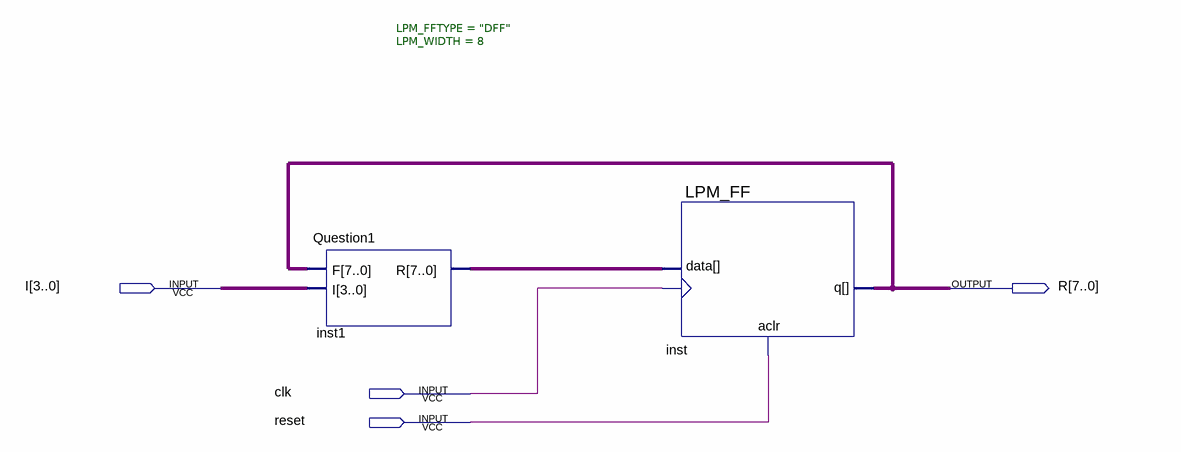
[diagram p0: schematic sheet]
// Quartus schematic accumulator.bdf as structural Verilog: 2 symbols, 4 pins
module accumulator (
  input  [3:0] I,
  input  clk,
  input  reset,
  output [7:0] R
);

  wire [7:0] inst1_r;

  Question1 inst1 (.F(R), .I(I), .R(inst1_r));
  LPM_FF #(.LPM_FFTYPE("DFF"), .LPM_WIDTH(8)) inst (.clock(clk), .aclr(reset), .data(inst1_r), .q(R));
endmodule
